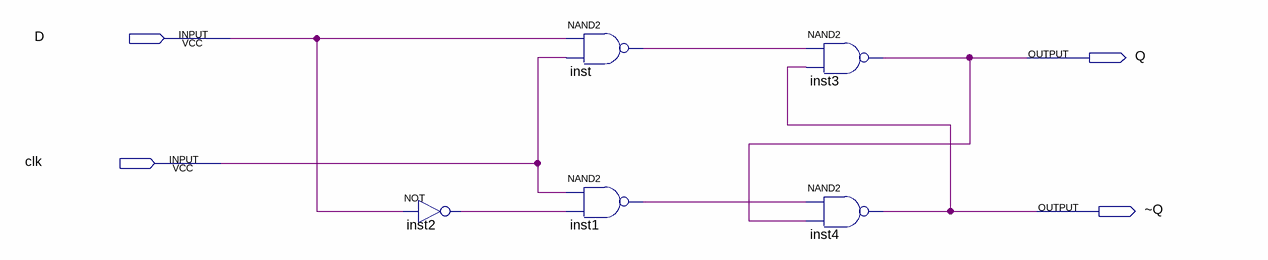
[diagram p0: schematic sheet]
// Quartus schematic step2.bdf as structural Verilog: 5 symbols, 4 pins
module step2 (
  input  D,
  input  clk,
  output Q,
  output \~Q 
);

  wire inst1_out, inst2_out, inst_out;

  not inst2 (inst2_out, D);
  nand inst (inst_out, D, clk);
  nand inst1 (inst1_out, clk, inst2_out);
  nand inst3 (Q, inst_out, \~Q );
  nand inst4 (\~Q , inst1_out, Q);
endmodule
